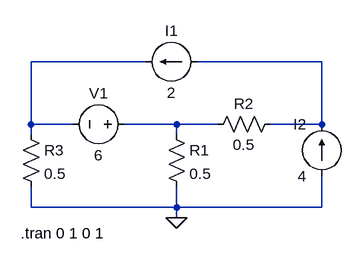
[diagram p0: schematic Circuit_8.asc]
Circuit_8.asc, the LTspice schematic file:
Version 4.1
SHEET 1 880 680
WIRE 176 32 0 32
WIRE 448 32 256 32
WIRE 0 128 0 32
WIRE 64 128 0 128
WIRE 224 128 144 128
WIRE 288 128 224 128
WIRE 448 128 448 32
WIRE 448 128 368 128
WIRE 0 144 0 128
WIRE 224 144 224 128
WIRE 0 256 0 224
WIRE 224 256 224 224
WIRE 224 256 0 256
WIRE 448 256 448 208
WIRE 448 256 224 256
WIRE 224 272 224 256
FLAG 224 272 0
SYMBOL voltage 160 128 R90
WINDOW 0 -32 56 VBottom 2
WINDOW 3 32 56 VTop 2
WINDOW 123 0 0 Left 0
WINDOW 39 0 0 Left 0
SYMATTR InstName V1
SYMATTR Value 6
SYMBOL current 256 32 R90
WINDOW 0 -32 40 VBottom 2
WINDOW 3 32 40 VTop 2
WINDOW 123 0 0 Left 0
WINDOW 39 0 0 Left 0
SYMATTR InstName I1
SYMATTR Value 2
SYMBOL current 448 208 R180
WINDOW 0 24 80 Left 2
WINDOW 3 24 0 Left 2
WINDOW 123 0 0 Left 0
WINDOW 39 0 0 Left 0
SYMATTR InstName I2
SYMATTR Value 4
SYMBOL res 208 128 R0
SYMATTR InstName R1
SYMATTR Value 0.5
SYMBOL res 384 112 R90
WINDOW 0 0 56 VBottom 2
WINDOW 3 32 56 VTop 2
SYMATTR InstName R2
SYMATTR Value 0.5
SYMBOL res -16 128 R0
SYMATTR InstName R3
SYMATTR Value 0.5
TEXT -16 296 Left 2 !.tran 0 1 0 1

The netlist it stands for:
* Circuit_8.asc
V1 N003 N001 6
I1 N002 N001 2
I2 0 N002 4
R1 N003 0 0.5
R2 N002 N003 0.5
R3 N001 0 0.5
.tran 0 1 0 1
.backanno
.end